# EAGLE schematic gamecontroller_Teensy__1.3 (EAGLE 9.3.0)
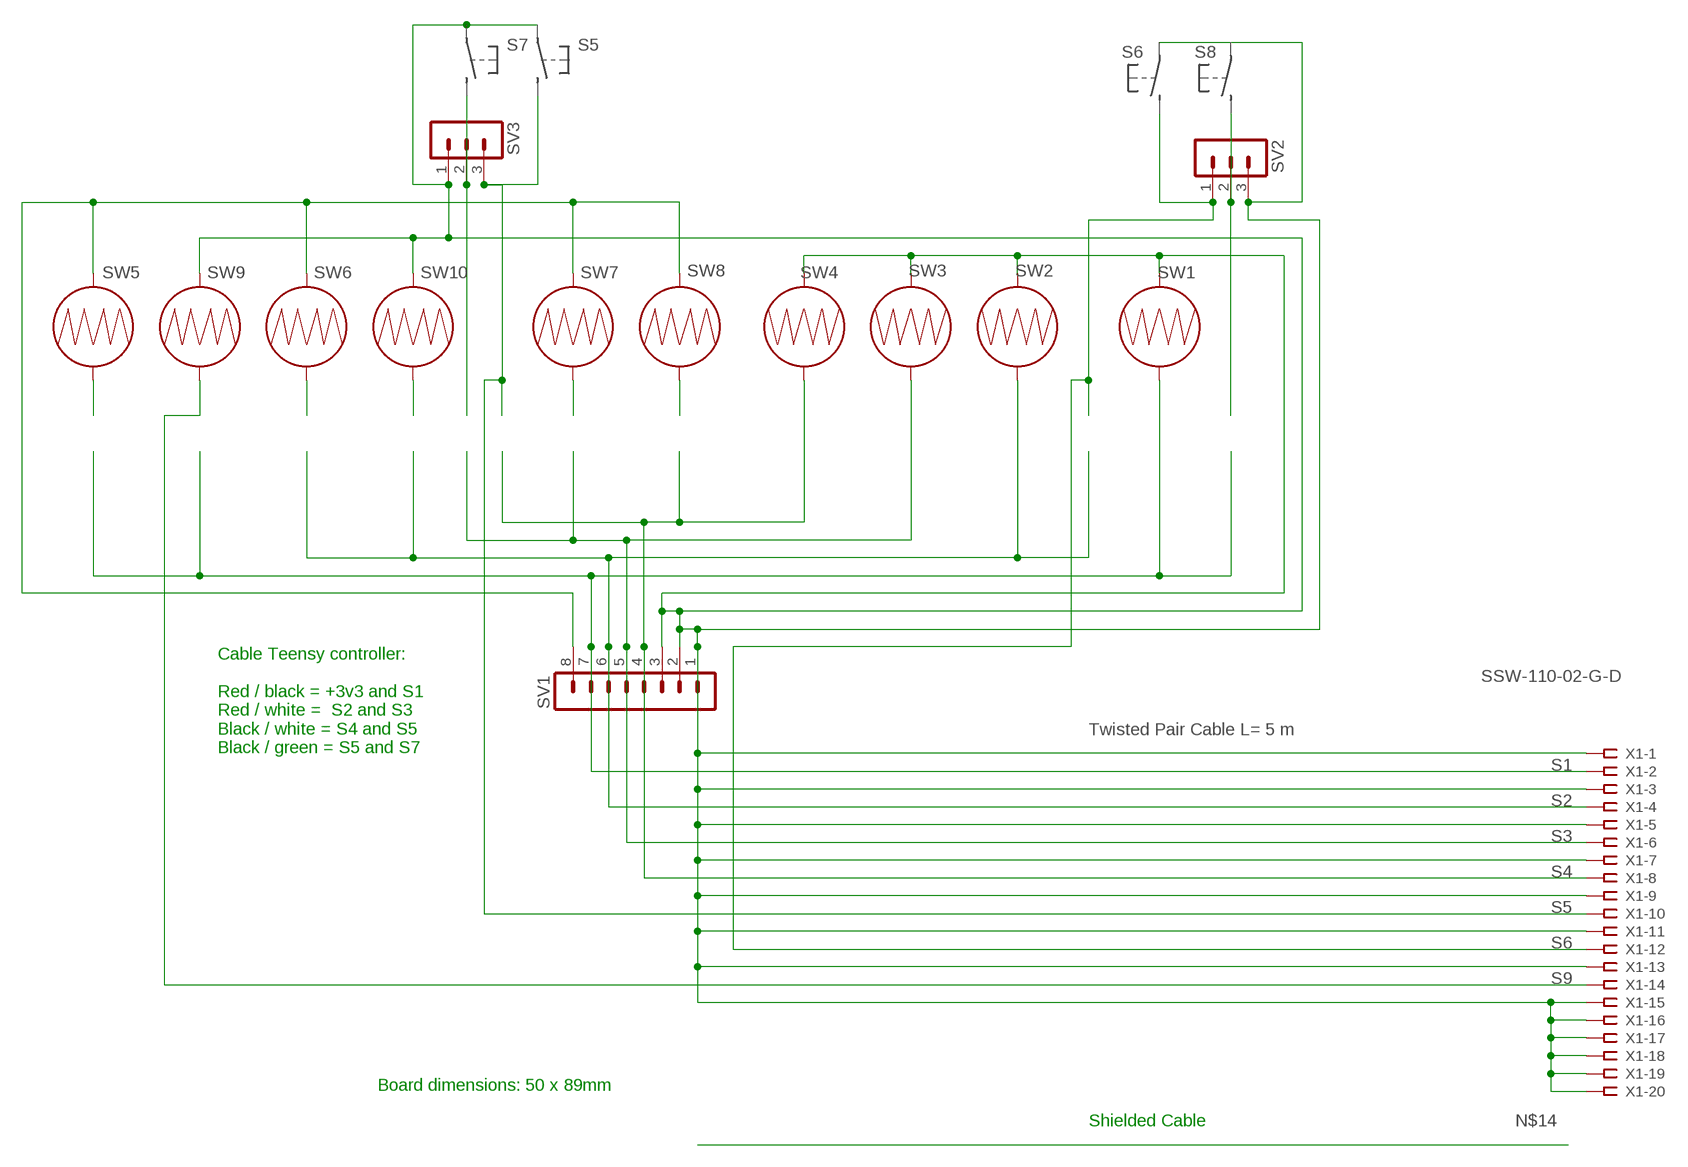
[diagram p0: schematic, sheet 1, part 1 of 2]
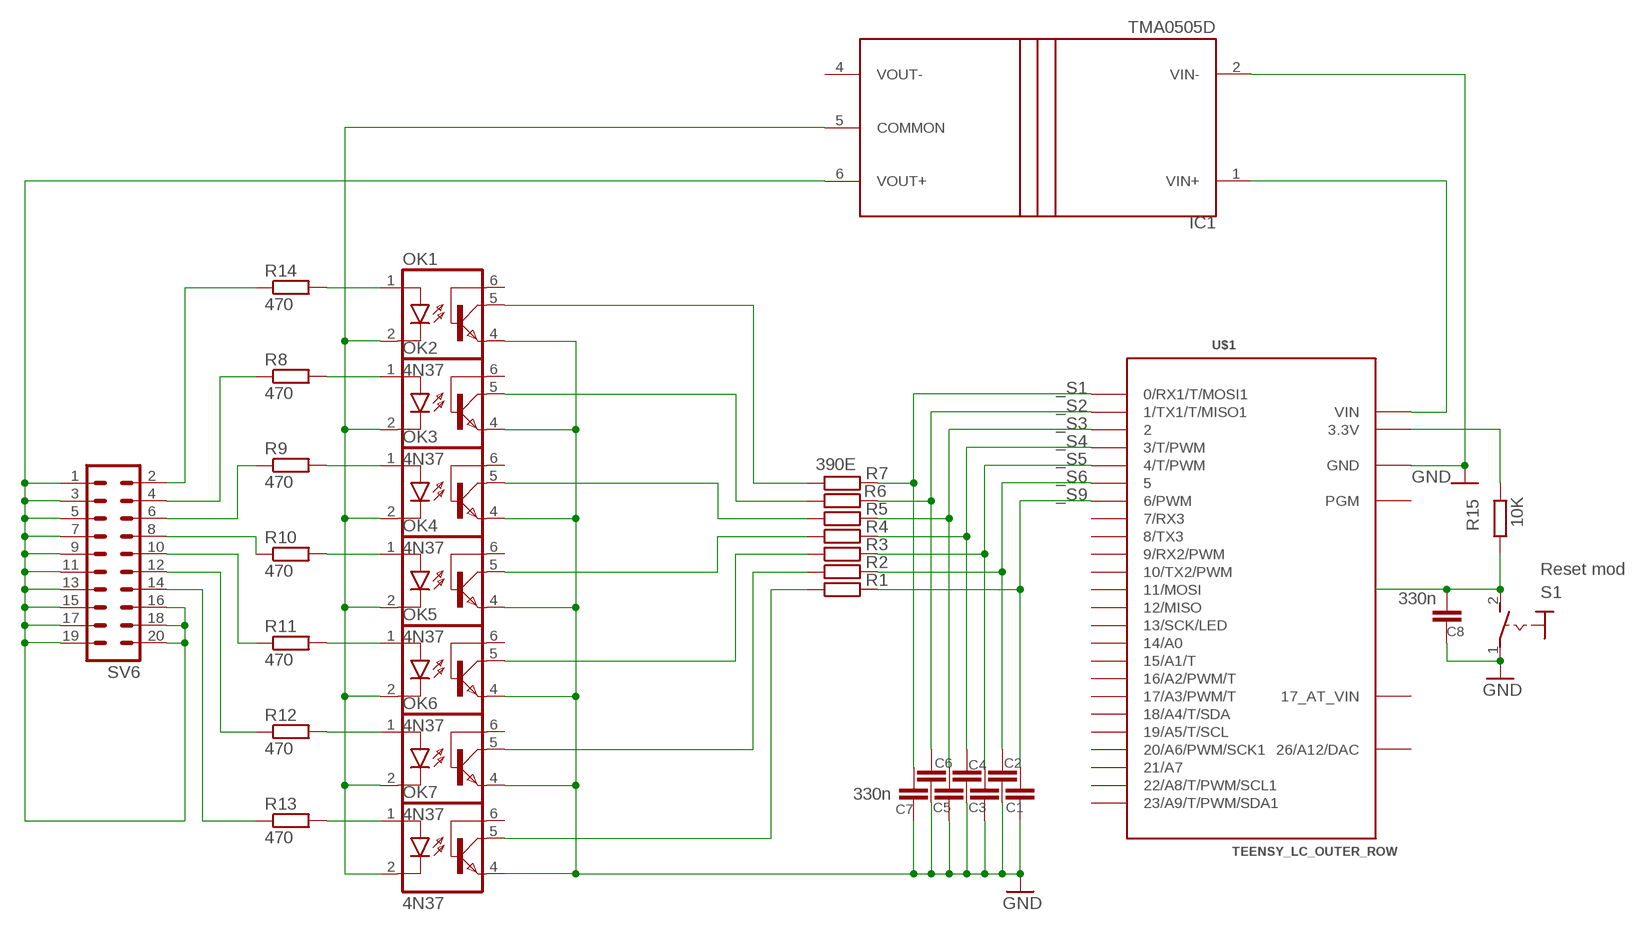
[diagram p1: schematic, sheet 1, part 2 of 2]

## Parts
C1  C-EU025-025X050  [C025-025X050]
C2  C-EU025-025X050  [C025-025X050]
C3  C-EU025-025X050  [C025-025X050]
C4  C-EU025-025X050  [C025-025X050]
C5  C-EU025-025X050  [C025-025X050]
C6  C-EU025-025X050  [C025-025X050]
C7  330n  C-EU025-025X050  [C025-025X050]
C8  330n  C-EU025-025X050  [C025-025X050]
IC1  TMA0505D  [SIP7]
OK1  4N37  [DIL06]
OK2  4N37  [DIL06]
OK3  4N37  [DIL06]
OK4  4N37  [DIL06]
OK5  4N37  [DIL06]
OK6  4N37  [DIL06]
OK7  4N37  [DIL06]
R1  R-EU_0204/5  [0204/5]
R2  R-EU_0204/5  [0204/5]
R3  R-EU_0204/5  [0204/5]
R4  R-EU_0204/5  [0204/5]
R5  R-EU_0204/5  [0204/5]
R6  R-EU_0204/5  [0204/5]
R7  390E  R-EU_0204/5  [0204/5]
R8  470  R-EU_0204/5  [0204/5]
R9  470  R-EU_0204/5  [0204/5]
R10  470  R-EU_0204/5  [0204/5]
R11  470  R-EU_0204/5  [0204/5]
R12  470  R-EU_0204/5  [0204/5]
R13  470  R-EU_0204/5  [0204/5]
R14  470  R-EU_0204/5  [0204/5]
R15  10K  R-EU_0204/5  [0204/5]
S1  Reset mod  MS243  [MS243]
SV1  MA08-1  [MA08-1]
SV2  MA03-1  [MA03-1]
SV3  MA03-1  [MA03-1]
SV6  MA10-2W  [MA10-2W]
SW1  BUTTON-CONDUCTIVESMD-0.1"  [BUTTON-CONDUCTIVE-0.1]
SW2  BUTTON-CONDUCTIVESMD-0.1"  [BUTTON-CONDUCTIVE-0.1]
SW3  BUTTON-CONDUCTIVESMD-0.1"  [BUTTON-CONDUCTIVE-0.1]
SW4  BUTTON-CONDUCTIVESMD-0.1"  [BUTTON-CONDUCTIVE-0.1]
SW5  BUTTON-CONDUCTIVESMD-0.1"  [BUTTON-CONDUCTIVE-0.1]
SW6  BUTTON-CONDUCTIVESMD-0.1"  [BUTTON-CONDUCTIVE-0.1]
SW7  BUTTON-CONDUCTIVESMD-0.1"  [BUTTON-CONDUCTIVE-0.1]
SW8  BUTTON-CONDUCTIVESMD-0.1"  [BUTTON-CONDUCTIVE-0.1]
SW9  BUTTON-CONDUCTIVESMD-0.1"  [BUTTON-CONDUCTIVE-0.1]
SW10  BUTTON-CONDUCTIVESMD-0.1"  [BUTTON-CONDUCTIVE-0.1]
U$1  TEENSY_LC_OUTER_ROW  [TEENSY_3.0-3.2&LC_OUTER_ROW]
X1  SSW-110-02-G-D  [SSW-110-02-G-D]

## Nets
_S1: C7.1 R7.2 U$1.0(0/RX1/T/MOSI1)
_S2: C6.1 R6.2 U$1.1(1/TX1/T/MISO1)
_S3: C5.1 R5.2 U$1.2
_S4: C4.1 R4.2 U$1.3(3/T/PWM)
_S5: C3.1 R3.2 U$1.4(4/T/PWM)
_S6: C2.1 R2.2 U$1.5
_S9: C1.1 R1.2 U$1.6(6/PWM)
COMMON: SV1.1 SV1.2 SV1.3 SV2.3 SV3.1 SW1.2 SW2.2 SW3.2 SW4.2 SW9.1 SW10.1 X1.1 X1.3 X1.5 X1.7 X1.9 X1.11 X1.13 X1.15 X1.16 X1.17 X1.18 X1.19 X1.20
GND: C1.2 C2.2 C3.2 C4.2 C5.2 C6.2 C7.2 C8.2 IC1.2(VIN-) OK1.4(EMI) OK2.4(EMI) OK3.4(EMI) OK4.4(EMI) OK5.4(EMI) OK6.4(EMI) OK7.4(EMI) S1.1(P) U$1.AGND(GND) U$1.GND U$1.GND1(GND)
N$1: R8.1 SV6.4
N$2: SV3.2
N$3: OK1.1(A) R14.2
N$4: SV1.8 SW5.1 SW6.1 SW7.1 SW8.1
N$5: SW10.2
N$6: R14.1 SV6.2
N$7: IC1.6(VOUT+) SV6.1 SV6.3 SV6.5 SV6.7 SV6.9 SV6.11 SV6.13 SV6.15 SV6.16 SV6.17 SV6.18 SV6.19 SV6.20
N$8: OK1.5(COL) R7.1
N$9: SW6.2
N$10: R9.1 SV6.6
N$11: SW8.2
N$12: SW5.2
N$13: R10.1 SV6.8
N$15: R11.1 SV6.10
N$16: SW7.2
N$17: R12.1 SV6.12
N$18: OK2.5(COL) R6.1
N$19: SV2.2
N$20: OK3.5(COL) R5.1
N$21: OK4.5(COL) R4.1
N$22: OK5.5(COL) R3.1
N$23: OK6.5(COL) R2.1
N$24: OK7.5(COL) R1.1
N$25: OK2.1(A) R8.2
N$26: OK3.1(A) R9.2
N$27: OK4.1(A) R10.2
N$28: C8.1 R15.1 S1.2(S)
N$29: R13.1 SV6.14
N$30: OK7.1(A) R13.2
N$31: OK6.1(A) R12.2
N$32: OK5.1(A) R11.2
N$33: IC1.1(VIN+) U$1.VIN
N$34: R15.2 U$1.3.3V U$1.3.3V1(3.3V)
N$35: IC1.5(COMMON) OK1.2(C) OK2.2(C) OK3.2(C) OK4.2(C) OK5.2(C) OK6.2(C) OK7.2(C)
S1: SV1.7 SW1.1 X1.2
S2: SV1.6 SW2.1 X1.4
S3: SV1.5 SW3.1 X1.6
S4: SV1.4 SW4.1 X1.8
S5: SV3.3 X1.10
S6: SV2.1 X1.12
S9: SW9.2 X1.14
Unconnected: OK1.6(BAS) OK2.6(BAS) OK3.6(BAS) OK4.6(BAS) OK5.6(BAS) OK6.6(BAS) OK7.6(BAS) U$1.7(7/RX3) U$1.8(8/TX3) U$1.9(9/RX2/PWM) U$1.10(10/TX2/PWM) U$1.11(11/MOSI) U$1.12(12/MISO) U$1.13(13/SCK/LED) U$1.14/A0 U$1.15/A1(15/A1/T) U$1.16/A2(16/A2/PWM/T) U$1.17/A3(17/A3/PWM/T) U$1.18/A4(18/A4/T/SDA) U$1.19/A5(19/A5/T/SCL) U$1.20/A6(20/A6/PWM/SCK1) U$1.21/A7 U$1.22/A8(22/A8/T/PWM/SCL1) U$1.23/A9(23/A9/T/PWM/SDA1) U$1.PGM U$1.VBAT(17_AT_VIN)

## Notes on the sheet
- Twisted Pair Cable L= 5 m
- Cable Teensy controller:
  
  Red / black = +3v3 and S1
  Red / white =  S2 and S3
  Black / white = S4 and S5
  Black / green = S5 and S7
- Board dimensions: 50 x 89mm
- Shielded Cable

## Power pins joined to a net without a drawn wire
26/A12/DAC: U$1.RESET/DAC(26/A12/DAC)
VOUT-: IC1.4(VOUT-)

## Library data of the parts
C1-C8 = rcl:C-EU: CAPACITOR, European symbol; SPICEPREFIX: C
IC1 = traco_tma:TMA: Traco Power TMA Series DC/DC Converter
OK1-OK7 = optocoupler:4N37: OPTO COUPLER Source: http://www.fairchildsemi.com/pf/4N/4N35-M.html; MF: FAIRCHILD SEMICONDUCTOR; MPN: 4N37; OC_FARNELL: 1612456; OC_NEWARK: 72K9948
R1-R15 = rcl:R-EU_: RESISTOR, European symbol; SPICEPREFIX: R
S1 = switch:MS243: TOGGLE SWITCH
SV1 = con-lstb:MA08-1: PIN HEADER; OC_FARNELL: unknown; OC_NEWARK: unknown
SV2 SV3 = con-lstb:MA03-1: PIN HEADER; OC_FARNELL: unknown; OC_NEWARK: unknown
SV6 = con-lstb:MA10-2W: PIN HEADER; OC_FARNELL: unknown; OC_NEWARK: unknown
SW1-SW10 = tglib2:BUTTON-CONDUCTIVE: Conductive Button Used with rubber key pads. This one was designed and proven to work with the PolyCase Key FOB enclosures.
U$1 = Teensy_3_and_LC_Series_Boards_v1.4:TEENSY_LC_OUTER_ROW: Teensy LC with only outer row of pins.
X1 = con-samtec:SSW-110-02-G: THROUGH-HOLE .025" SQ POST SOCKET Source: Samtec SSW.pdf; MF: Samtec Inc.; MPN: SSW-110-02-G-D; OC_FARNELL: unknown; OC_NEWARK: 11P9480